# Altium project UHF Transceiver.PrjPCB (part 1 of 3)
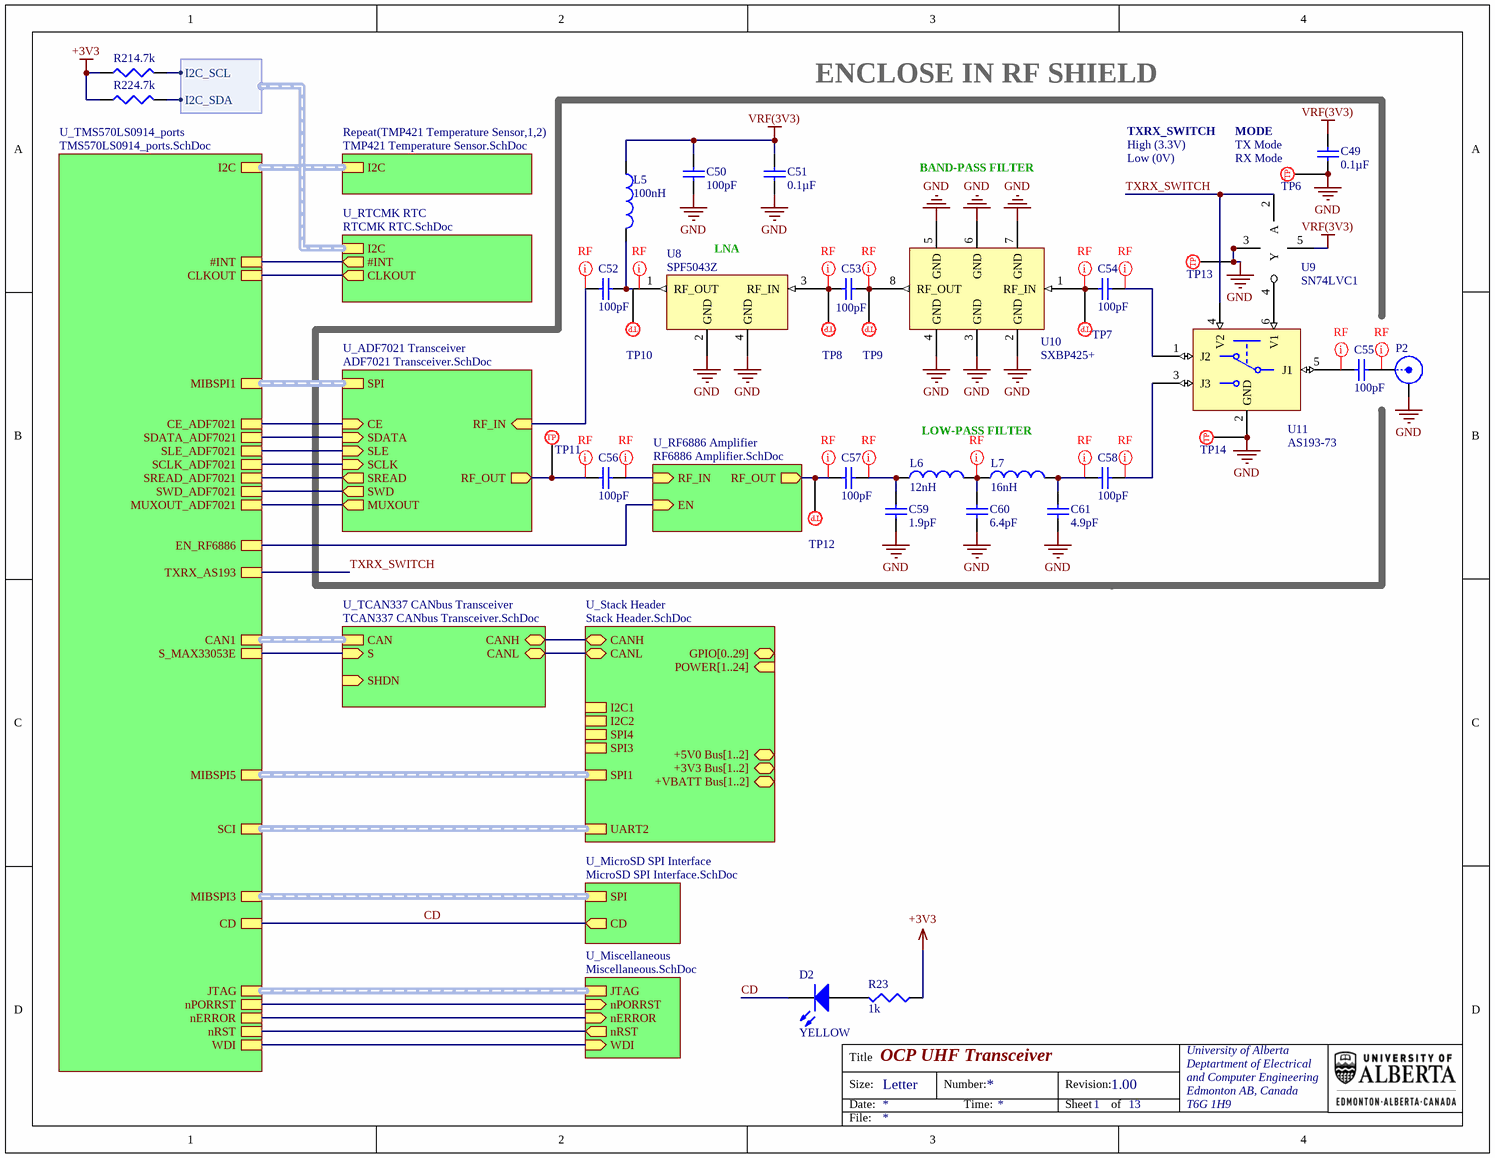
[diagram p0: UHF Transceiver Schematic.SchDoc]
11 sheets, 187 parts. Net scope: hierarchical (ports join the sheet entries above them; power ports are global).
Board file: UHF Transceiver PCB.PcbDoc
Sheets:
  UHF Transceiver Schematic.SchDoc
    TMP421 Temperature Sensor1 = TMP421 Temperature Sensor.SchDoc
    TMP421 Temperature Sensor2 = TMP421 Temperature Sensor.SchDoc
    U_RF6886 Amplifier = RF6886 Amplifier.SchDoc
    U_ADF7021 Transceiver = ADF7021 Transceiver.SchDoc
    U_RTCMK RTC = RTCMK RTC.SchDoc
    U_Stack Header = Stack Header.SchDoc
    U_MicroSD SPI Interface = MicroSD SPI Interface.SchDoc
    U_Miscellaneous = Miscellaneous.SchDoc
    U_TMS570LS0914_ports = TMS570LS0914_ports.SchDoc
      U_TMS570LS0914_all = TMS570LS0914_all.SchDoc
    U_TCAN337 CANbus Transceiver = TCAN337 CANbus Transceiver.SchDoc

## Sheet UHF Transceiver Schematic.SchDoc: OCP UHF Transceiver
size Letter; Revision: 1.00; SheetNumber: 1; SheetTotal: 13

### Parts
C49  value 0.1µF  [TDK-CGA2B]  (hidden comment: Cap)
C50  value 100pF  [KEM-CBR04]  (hidden comment: Cap)
C51  value 0.1µF  [TDK-CGA2B]  (hidden comment: Cap)
C52  value 100pF  [KEM-CBR04]  (hidden comment: Cap)
C53  value 100pF  [KEM-CBR04]  (hidden comment: Cap)
C54  value 100pF  [KEM-CBR04]  (hidden comment: Cap)
C55  value 100pF  [KEM-CBR04]  (hidden comment: Cap)
C56  value 100pF  [KEM-CBR04]  (hidden comment: Cap)
C57  value 100pF  [KEM-CBR04]  (hidden comment: Cap)
C58  value 100pF  [KEM-CBR04]  (hidden comment: Cap)
C59  value 1.9pF  [KEM-CBR04]  (hidden comment: Cap)
C60  value 6.4pF  [KEM-CBR04]  (hidden comment: Cap)
C61  value 4.9pF  [KEM-CBR04]  (hidden comment: Cap)
D2  value YELLOW  [WL-150060XS75000]  (hidden comment: LED)
L5  value 100nH  [TDK-MLF1005]  (hidden comment: MLF1005VR10JTD25)
L6  value 12nH  [MUR-LQW15A]  (hidden comment: LQW15AN12NG8ZD)
L7  value 16nH  [MUR-LQW15A]  (hidden comment: LQW15AN16NG8ZD)
P2  903-518J-51P  [AMP-903-518J-51P]  (value not drawn)
R21  value 4.7k  [PANA-ERJ2R]  (hidden comment: Res3)
R22  value 4.7k  [PANA-ERJ2R]  (hidden comment: Res3)
R23  value 1k  [PANA-ERJ3EK]  (hidden comment: Res3)
TP6  5017  [KS-5017]  (value not drawn)
TP7  5017  [KS-5017]  (value not drawn)
TP8  5017  [KS-5017]  (value not drawn)
TP9  5017  [KS-5017]  (value not drawn)
TP10  5017  [KS-5017]  (value not drawn)
TP11  5017  [KS-5017]  (value not drawn)
TP12  5017  [KS-5017]  (value not drawn)
TP13  5017  [KS-5017]  (value not drawn)
TP14  5017  [KS-5017]  (value not drawn)
U8  SPF5043Z  [QRV-SOT-343-4]
U9  SN74LVC1  [TI-DBV0005A]
U10  SXBP425+  [MICI-SXBP]
U11  AS193-73  [SKYW-SOT-6]

### Sub-sheets
Repeat(TMP421 Temperature Sensor,1,2) = TMP421 Temperature Sensor.SchDoc: I2C (harness MCU_I2C0)
U_ADF7021 Transceiver = ADF7021 Transceiver.SchDoc: RF_OUT (out), RF_IN (in), CE (in), SDATA (in), SREAD (out), SLE (in), SWD (out), SCLK (in), MUXOUT (out), SPI (harness ADF7021_SPI)
U_MicroSD SPI Interface = MicroSD SPI Interface.SchDoc: CD (out), SPI (harness MicroSD_SPI)
U_Miscellaneous = Miscellaneous.SchDoc: JTAG (harness TMS570_JTAG), nRST (out), nERROR (in), nPORRST (in), WDI (in)
U_RF6886 Amplifier = RF6886 Amplifier.SchDoc: RF_IN (in), RF_OUT (out), EN (in)
U_RTCMK RTC = RTCMK RTC.SchDoc: CLKOUT (out), #INT (out), I2C (harness MCU_I2C0)
U_Stack Header = Stack Header.SchDoc: CANH (bidir), CANL (bidir), SPI1 (harness STACK_SPI1), I2C1 (harness STACK_I2C1), SPI3 (harness STACK_SPI3), GPIO[0..29] (bidir), +VBATT Bus[1..2] (bidir), POWER[1..24] (in), SPI4 (harness STACK_SPI0), I2C2 (harness STACK_I2C0), +5V0 Bus[1..2] (bidir), +3V3 Bus[1..2] (bidir), UART2 (harness STACK_UART2)
U_TCAN337 CANbus Transceiver = TCAN337 CANbus Transceiver.SchDoc: CANH (bidir), CANL (bidir), CAN (harness MAX33053E_CAN), S (in), SHDN (in)
U_TMS570LS0914_ports = TMS570LS0914_ports.SchDoc: nRST, nPORRST, SREAD_ADF7021, CE_ADF7021, SWD_ADF7021, MUXOUT_ADF7021, SDATA_ADF7021, SLE_ADF7021, SCLK_ADF7021, TXRX_AS193, CD, #INT, S_MAX33053E, EN_RF6886, CLKOUT, WDI, nERROR, I2C (harness MCU_I2C0), CAN1, MIBSPI5, SCI, MIBSPI1, JTAG, MIBSPI3

### Harnesses
MCU_I2C0: I2C_SCL, I2C_SDA

### Nets
+3V3: R21.1 R22.1 R23.1  [project net POWER19]
GND: C49.2 C50.1 C51.2 C59.1 C60.1 C61.1 P2.2(Y) TP6.1 TP13.1 TP14.1 U8.2(GND) U8.4(GND) U9.1(NC) U9.3(GND) U10.2(GND) U10.3(GND) U10.4(GND) U10.5(GND) U10.6(GND) U10.7(GND) U11.2(GND)
VRF(3V3): C49.1 C50.2 C51.1 L5.1 U9.5(VCC)
CAN_N: sheet U_Stack Header/CANL, sheet U_TCAN337 CANbus Transceiver/CANL
CAN_P: sheet U_Stack Header/CANH, sheet U_TCAN337 CANbus Transceiver/CANH
CD: D2.2(K) ; sheet U_MicroSD SPI Interface/CD, sheet U_TMS570LS0914_ports/CD
EPWM1A: sheet U_ADF7021 Transceiver/CE, sheet U_TMS570LS0914_ports/CE_ADF7021
EPWM1B: sheet U_ADF7021 Transceiver/SDATA, sheet U_TMS570LS0914_ports/SDATA_ADF7021
EPWM2A: sheet U_ADF7021 Transceiver/SLE, sheet U_TMS570LS0914_ports/SLE_ADF7021
EPWM3A: sheet U_RTCMK RTC/CLKOUT, sheet U_TMS570LS0914_ports/CLKOUT
EQEP2A: sheet U_RF6886 Amplifier/EN, sheet U_TMS570LS0914_ports/EN_RF6886
EQEP2I: sheet U_ADF7021 Transceiver/MUXOUT, sheet U_TMS570LS0914_ports/MUXOUT_ADF7021
GIOA0: sheet U_ADF7021 Transceiver/SREAD, sheet U_TMS570LS0914_ports/SREAD_ADF7021
GIOA1: sheet U_ADF7021 Transceiver/SWD, sheet U_TMS570LS0914_ports/SWD_ADF7021
GIOB0: sheet U_ADF7021 Transceiver/SCLK, sheet U_TMS570LS0914_ports/SCLK_ADF7021
GIOB1: sheet U_RTCMK RTC/#INT, sheet U_TMS570LS0914_ports/#INT
GIOB2: sheet U_TMS570LS0914_ports/S_MAX33053E, sheet U_TCAN337 CANbus Transceiver/S
I2C_SCL: R21.2 ; sheet Repeat(TMP421 Temperature Sensor,1,2)/I2C.I2C_SCL
I2C_SDA: R22.2 ; sheet Repeat(TMP421 Temperature Sensor,1,2)/I2C.I2C_SDA
N2HET1_24: sheet U_Miscellaneous/WDI, sheet U_TMS570LS0914_ports/WDI
nERROR: sheet U_Miscellaneous/nERROR, sheet U_TMS570LS0914_ports/nERROR
nPORRST: sheet U_Miscellaneous/nPORRST, sheet U_TMS570LS0914_ports/nPORRST
nRST: sheet U_Miscellaneous/nRST, sheet U_TMS570LS0914_ports/nRST
TXRX_SWITCH: U9.2(A) U11.4(V2) ; sheet U_TMS570LS0914_ports/TXRX_AS193  [project net GIOB3]
NetC41_2: C57.2 TP12.1 ; sheet U_RF6886 Amplifier/RF_OUT
NetC44_1: C56.1 ; sheet U_RF6886 Amplifier/RF_IN
NetC52_1: C52.1 L5.2 TP10.1 U8.1(RF_OUT)
NetC52_2: C52.2 ; sheet U_ADF7021 Transceiver/RF_IN
NetC53_1: C53.1 TP9.1 U10.8(RF_OUT)
NetC53_2: C53.2 TP8.1 U8.3(RF_IN)
NetC54_1: C54.1 U11.1(J2)
NetC54_2: C54.2 TP7.1 U10.1(RF_IN)
NetC55_1: C55.1 P2.1(X)
NetC55_2: C55.2 U11.5(J1)
NetC56_2: C56.2 TP11.1 ; sheet U_ADF7021 Transceiver/RF_OUT
NetC57_1: C57.1 C59.2 L6.1
NetC58_1: C58.1 U11.3(J3)
NetC58_2: C58.2 C61.2 L7.2
NetC60_2: C60.2 L6.2 L7.1
NetD2_1: D2.1(A) R23.2
NetU9_4: U9.4(Y) U11.6(V1)

### Buses and harness runs
harness sheet Repeat(TMP421 Temperature Sensor,1,2)/I2C = sheet U_RTCMK RTC/I2C = sheet U_TMS570LS0914_ports/I2C
harness sheet U_ADF7021 Transceiver/SPI = sheet U_TMS570LS0914_ports/MIBSPI1
harness sheet U_MicroSD SPI Interface/SPI = sheet U_TMS570LS0914_ports/MIBSPI3
harness sheet U_Miscellaneous/JTAG = sheet U_TMS570LS0914_ports/JTAG
harness sheet U_Stack Header/SPI1 = sheet U_TMS570LS0914_ports/MIBSPI5
harness sheet U_Stack Header/UART2 = sheet U_TMS570LS0914_ports/SCI
harness sheet U_TCAN337 CANbus Transceiver/CAN = sheet U_TMS570LS0914_ports/CAN1

### Layout directives
net class RF; rule Impedance Constraint [Min = 50.00    Max = 50.00    ]: (no net found under the mark), NetC41_2, NetC44_1, NetC52_2, NetC53_1, NetC53_2, NetC54_1, NetC54_2, NetC55_1, NetC55_2, NetC56_2, NetC57_1, NetC58_1, NetC58_2, NetC60_2

### Notes on the sheet
- ENCLOSE IN RF SHIELD
- BAND-PASS FILTER
- TXRX_SWITCH
- High (3.3V)
- Low (0V)
- MODE
- (near TP6) TX Mode
- (near TP6) RX Mode
- (near U8) LNA
- LOW-PASS FILTER
- Title
- Size:
- Date:
- Letter
- Number:
- Time:
- Revision:
- Sheet
- of
- University of Alberta
- Deptartment of Electrical
- and Computer Engineering
- Edmonton AB, Canada
- T6G 1H9
- File:
- (in symbol PTP-KS-00001) TP

### Library data of the parts
C49 C51 = PC-TDK-02259: CAP CER 0.1UF 50V X7R 0402; Manufacturer Part Number: CGA2B3X7R1H104K050BB; Index: 2259; Designator: C?; Tolerance: ±10%; Published: 2016-03-16; LatestRevisionDate: 2016-03-16; LatestRevisionNote: ...; PackageReference: 0402 (1005 Metric); Publisher: AlbertaSat; PackageDescription: Radial Cap, Thru-Hole; 2 Leads; 0.3 in Pin Spacing; Part Number: PC-TDK-02259; Supplier Part Number 1: 445-6899-1-ND; Supplier 1: Digi-key; Supplier Link: http://www.digikey.ca/product-search/en?keywords=445-6899-1-ND; Voltage - Rated: 50V; Temperature Coefficient: X7R; Applications: Automotive
C50 C52-C58 = PC-KEM-03159: CAP CER SMD CBR 0402 100PF 5% 25; Manufacturer Part Number: CBR04C101J3GAC; Index: 3159; Designator: C?; Voltage - Rated: 25V; Temperature Coefficient: C0G, NP0; Published: 2018-08-29; LatestRevisionDate: 2018-08-29; LatestRevisionNote: ...; PackageReference: 0402 (1005 Metric); Publisher: AlbertaSat; PackageDescription: Chip Capacitor, 2-Leads, Body 1.00x0.50mm, IPC Low Density; Part Number: PC-KEM-03159; Supplier Part Number 1: 399-17684-1-ND; Supplier 1: Digi-key; Supplier Link: https://www.digikey.ca/products/en?keywords=399-17684-1-ND; Tolerance: ±5%; Applications: High Q, Low Loss, Ultra Low ESR
C59 = PC-KEM-02905: CAP CER RF 1.9PF 50V +/-0.1 PF C; Manufacturer Part Number: CBR04C199B5GAC; Index: 2905; Designator: C?; Tolerance: ±0.1pF; Temperature Coefficient: C0G, NP0; Published: 2018-08-29; LatestRevisionDate: 2018-08-29; LatestRevisionNote: ...; PackageReference: 0402 (1005 Metric); Publisher: AlbertaSat; PackageDescription: Chip Capacitor, 2-Leads, Body 1.00x0.50mm, IPC Low Density; Part Number: PC-KEM-02905; Supplier Part Number 1: 399-16064-1-ND; Supplier 1: Digi-key; Supplier Link: https://www.digikey.ca/products/en?keywords=399-16064-1-ND; Voltage - Rated: 50V; Applications: High Q, Low Loss, Ultra Low ESR
C60 = PC-KEM-03022: CAP CER RF 6.4PF 50V +/-0.1 PF C; Manufacturer Part Number: CBR04C649B5GAC; Index: 3022; Designator: C?; Tolerance: ±0.1pF; Temperature Coefficient: C0G, NP0; Published: 2018-08-29; LatestRevisionDate: 2018-08-29; LatestRevisionNote: ...; PackageReference: 0402 (1005 Metric); Publisher: AlbertaSat; PackageDescription: Chip Capacitor, 2-Leads, Body 1.00x0.50mm, IPC Low Density; Part Number: PC-KEM-03022; Supplier Part Number 1: 399-16107-1-ND; Supplier 1: Digi-key; Supplier Link: https://www.digikey.ca/products/en?keywords=399-16107-1-ND; Voltage - Rated: 50V; Applications: High Q, Low Loss, Ultra Low ESR
C61 = PC-KEM-02983: CAP CER RF 4.9PF 50V +/-0.1 PF C; Manufacturer Part Number: CBR04C499B5GAC; Index: 2983; Designator: C?; Tolerance: ±0.1pF; Temperature Coefficient: C0G, NP0; Published: 2018-08-29; LatestRevisionDate: 2018-08-29; LatestRevisionNote: ...; PackageReference: 0402 (1005 Metric); Publisher: AlbertaSat; PackageDescription: Chip Capacitor, 2-Leads, Body 1.00x0.50mm, IPC Low Density; Part Number: PC-KEM-02983; Supplier Part Number 1: 399-16093-1-ND; Supplier 1: Digi-key; Supplier Link: https://www.digikey.ca/products/en?keywords=399-16093-1-ND; Voltage - Rated: 50V; Applications: High Q, Low Loss, Ultra Low ESR
D2 = 5: LED YELLOW CLEAR 0603 SMD; Part Number: 5; Manufacturer Part Number: 150060YS75000; Designator: D?; Brightness: 120mcd; Published: 8-Jun-2000; LatestRevisionDate: 08-Jul-2005; LatestRevisionNote: Mech Layer 1 removed.; PackageReference: WL-150060XS75000; Publisher: Altium Limited; PackageDescription: LED; 2 Leads; Supplier Part Number 1: 732-4981-1-ND; Supplier 1: Digi-Key; Supplier Link: http://www.digikey.ca/product-search/en?keywords=732-4981-1-ND
L5 = PL-TDK-02957: FIXD IND 100NH 180MA 510MOHM SMD; Code_IEC: 1005; Index: 2957; Designator: L?; Tolerance: ±5%; Published: 2018-12-12; LatestRevisionDate: 2018-12-12; LatestRevisionNote: ...; PackageReference: 0402 (1005 Metric); Publisher: AlbertaSat; PackageDescription: Chip Inductor, 2-Leads, Body 1.00x0.50mm, IPC Low Density; Code_JEITA: 0402; Part Number: PL-TDK-02957; Manufacturer Part Number: MLF1005VR10JTD25; Supplier Part Number 1: 445-180212-1-ND; Supplier 1: Digi-key; Supplier Part Number 2: 810-MLF1005VR10JTD25; Supplier 2: Mouser; Supplier Link: #https://www.digikey.ca/product-detail/en/tdk-corporation/MLF1005VR10JTD25/445-180212-1-ND/8638399#; Current - Rated: 180mA
L6 = 10160: FIXED IND 12NH 1.24A 93 MOHM; Part Number: 10160; Code_IEC: 1005; Designator: L?; DC Resistance: 93 mOhm Max; Tolerance: ±2%; Published: 8-Jun-2000; LatestRevisionDate: 29-May-2009; LatestRevisionNote: IPC-7351 Footprint Added.; PackageReference: 0402 (1005 Metric); Publisher: Altium Limited; PackageDescription: Chip Inductor, 2-Leads, Body 1.00x0.60mm, IPC Low Density; Code_JEITA: 0402; Manufacturer Part Number: LQW15AN12NG8ZD; Supplier Part Number 1: 490-15335-1-ND; Supplier 1: Digi-Key; Supplier Link: #https://www.digikey.ca/product-detail/en/murata-electronics-north-america/LQW15AN12NG8ZD/490-15335-1-ND/6800000#
L7 = 10161: FIXED IND 16NH 1A 126 MOHM; Part Number: 10161; Code_IEC: 1005; Designator: L?; DC Resistance: 126 mOhm Max; Tolerance: ±2%; Published: 8-Jun-2000; LatestRevisionDate: 29-May-2009; LatestRevisionNote: IPC-7351 Footprint Added.; PackageReference: 0402 (1005 Metric); Publisher: Altium Limited; PackageDescription: Chip Inductor, 2-Leads, Body 1.00x0.60mm, IPC Low Density; Code_JEITA: 0402; Manufacturer Part Number: LQW15AN16NG8ZD; Supplier Part Number 1: 490-15343-1-ND; Supplier 1: Digi-Key; Supplier Link: #https://www.digikey.ca/product-detail/en/murata-electronics-north-america/LQW15AN16NG8ZD/490-15343-1-ND/6800008#
P2 = PP-AMP-00002: CONN SMB JACK STR 50OHM EDGE MNT; Index: 2; Designator: P?; LatestRevisionDate: 2018-12-20; LatestRevisionNote: ...; Publisher: AlbertaSat; Part Number: PP-AMP-00002; Manufacturer Part Number: 903-518J-51P; Supplier Part Number 1: ARF1721-ND; Supplier 1: Digi-key; Supplier Part Number 2: 523-903-518J-51P; Supplier 2: Mouser; Published: 2018-12-20; PackageReference: CONN SMB JACK STR 50OHM EDGE MNT; PackageDescription: CONN SMB JACK STR 50OHM EDGE MNT; Supplier Link: #https://www.digikey.ca/product-detail/en/amphenol-rf-division/903-518J-51P/ARF1721-ND/2041847#
R21 R22 = 16657: RES SMD 4.7K OHM 1% 1/10W 0402; Part Number: 16657; Manufacturer Part Number: ERJ-2RKF4701X; Designator: R?; Power: 0.1W, 1/10W; Temperature Coefficient: ±100ppm/°C; Published: 8-Jun-2000; LatestRevisionDate: 29-May-2009; LatestRevisionNote: IPC-7351 Footprint Added.; PackageReference: 0402 (1005 Metric); Publisher: Altium Limited; PackageDescription: Chip Resistor, 2-Leads, Body 1.00x0.50mm, IPC Low Density; Supplier Part Number 1: P4.70KLCT-ND; Supplier 1: Digi-Key; Supplier Link: http://www.digikey.ca/product-search/en?keywords=P4.70KLCT-ND; Tolerance: ±1%
R23 = 15398: RES SMD 1K OHM 1% 1/10W 0603; Part Number: 15398; Manufacturer Part Number: ERJ-3EKF1001V; Designator: R?; Power: 0.1W, 1/10W; Temperature Coefficient: ±100ppm/°C; Published: 8-Jun-2000; LatestRevisionDate: 29-May-2009; LatestRevisionNote: IPC-7351 Footprint Added.; PackageReference: 0603 (1608 Metric); Publisher: Altium Limited; PackageDescription: Chip Resistor, 2-Leads, Body 1.60x0.80mm, IPC Low Density; Supplier Part Number 1: P1.00KHCT-ND; Supplier 1: Digi-Key; Supplier Link: http://www.digikey.ca/product-search/en?keywords=P1.00KHCT-ND; Tolerance: ±1%
TP6-TP14 = PTP-KS-00001: PC TEST POINT MINI SMD; Index: 1; Designator: TP?; Supplier 1: Digi-key; Supplier 2: Newark; Supplier 3: Mouser; Part Number: PTP-KS-00001; Manufacturer Part Number: 5017; Supplier Part Number 1: 36-5017CT-ND; Publisher: AlbertaSat; Published: 2016-03-15; LatestRevisionDate: 2016-03-15; LatestRevisionNote: ...; PackageReference: KS-5017; PackageDescription: Testpoint Lug Mini SMD 27X10X152; Supplier Link: #http://www.digikey.ca/product-detail/en/keystone-electronics/5017/36-5017TR-ND/2217304#
U8 = PU-QRV-00002: RF Amplifier .05-4GHz SSG 12.9dB NF .8dB GaAs; Index: 2; Designator: U?; Opperating Supply Current: 46 mA; Operating Frequency: 50 MHz to 4 GHz; Operating Supply Voltage: 5V; Part Number: PU-QRV-00002; Manufacturer Part Number: SPF5043Z; Supplier Part Number 1: 772-SPF5043Z; Supplier 1: Mouser; Supplier Part Number 2: SPF5043Z; Supplier 2: Avnet Asia; Publisher: AlbertaSat; Published: 2018-05-28; LatestRevisionDate: 2018-05-28; LatestRevisionNote: ...; PackageReference: SOT-343-4; PackageDescription: SOT143, 4-Leads, Body 2.00x2.10mm, Pitch 1.30mm, IPC Medium Density; Supplier Link: #https://www.mouser.ca/ProductDetail/Qorvo/SPF5043Z?qs=p6lVfQR1GSoUob90DTnCEA%3D%3D#; Gain: 12.9 dB; Operating Temperature: -40°C ~ 85°C (TA; Applications: Wireless & RF Integrated Circuits
U9 = 52: IC INVERTER SCHMITT 1CH SOT23-5; Part Number: 52; Manufacturer Part Number: SN74LVC1G14MDBVREP; Designator: U?; Voltage - Supply: 1.65 V ~ 5.5 V; Current - Output (Max): ±50 mA; Supplier Part Number 2: 595-SN74LVC14MDBVREP; Supplier 2: Mouser; Supplier Part Number 1: 296-22346-1-ND; Supplier 1: Digi-Key; Supplier Link: #https://www.digikey.ca/products/en?keywords=296-22346-1-ND#; PackageReference: SOT-23-5, SC-74A, SOT-753; Operating Temperature: -55°C ~ 125°C
U10 = PU-MICI-00002: Band Pass Filter; Index: 2; Designator: U?; PassBand: 410 to 440 MHz; Part Number: PU-MICI-00002; Manufacturer Part Number: SXBP-425+; Supplier Part Number 1: SXBP-425+; Supplier 1: Mini Circuits; Publisher: AlbertaSat; Published: 2018-12-19; LatestRevisionDate: 2018-12-19; LatestRevisionNote: ...; Supplier Link: #https://www.minicircuits.com/WebStore/dashboard.html?model=SXBP-425%2B#
U11 = PU-SKYW-00003: IC SW SPDT 0.1-2.5GHZ SOT6; Manufacturer Part Number: AS193-73LF; Index: 3; Designator: U?; Part Number: PU-SKYW-00003; Supplier Part Number 1: 863-1006-1-ND; Supplier 1: Digi-key; Supplier Part Number 2: 873-AS193-73LF; Supplier 2: Mouser; Publisher: AlbertaSat; Published: 2018-05-18; LatestRevisionDate: 2018-05-18; LatestRevisionNote: ...; PackageReference: SOT-23 6L; PackageDescription: SOT23, 6-Leads, Body 2.90x2.70mm, Pitch 0.95mm, IPC Medium Density; Supplier Link: #https://www.digikey.ca/products/en?keywords=863-1006-1-ND#

## Sheet TMP421 Temperature Sensor.SchDoc: TMP421 Temperature Sensor
size Letter; SheetNumber: 10; SheetTotal: 11
Used 2 times, as channels TMP421 Temperature Sensor1, TMP421 Temperature Sensor2. Parts and nets are listed once, with the designators drawn on the sheet.
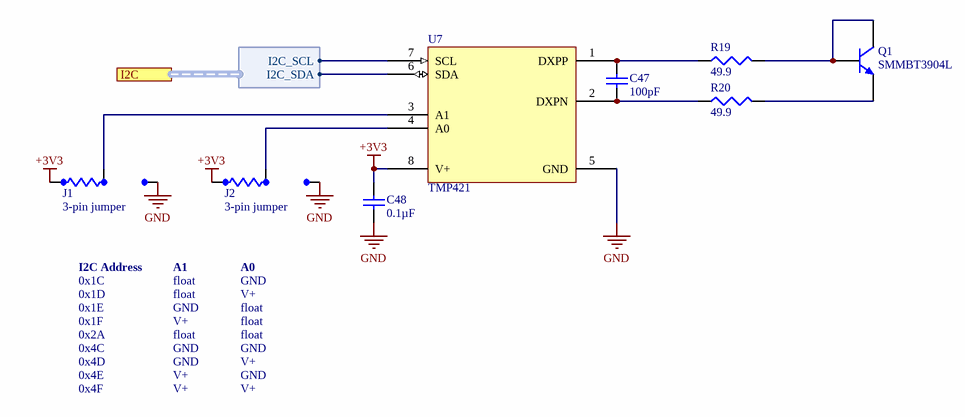
[diagram p1: TMP421 Temperature Sensor.SchDoc]

### Parts
C47  value 100pF  [TDK-CGA2B]  (hidden comment: Cap)
C48  value 0.1µF  [TDK-CGA2B]  (hidden comment: Cap)
J1  3-pin jumper  [PANA-ERJ3EK(3-pin jumper)]
J2  3-pin jumper  [PANA-ERJ3EK(3-pin jumper)]
Q1  SMMBT3904L  [ONS-318-08]
R19  value 49.9  [PANA-ERA2A]  (hidden comment: Res3)
R20  value 49.9  [PANA-ERA2A]  (hidden comment: Res3)
U7  TMP421  [TI-DCN]

### Ports
I2C (harness TMP421_I2C)

### Harnesses
TMP421_I2C: I2C_SCL, I2C_SDA

### Nets
+3V3: C48.1 J1.3 J2.3 U7.8(V+)
GND: C48.2 J1.1 J2.1 U7.5(GND)
NetC47_1: C47.1 R20.1 U7.2(DXPN)
NetC47_2: C47.2 R19.1 U7.1(DXPP)
NetJ1_2: J1.2 U7.3(A1)
NetJ2_2: J2.2 U7.4(A0)
NetQ1_1: Q1.1(B) Q1.3(C) R19.2
NetQ1_2: Q1.2(E) R20.2
NetU7_6: U7.6(SDA) ; port I2C.I2C_SDA
NetU7_7: U7.7(SCL) ; port I2C.I2C_SCL

### Channels
TMP421 Temperature Sensor1: designators end in _TMP421_Temperature_Sensor1
TMP421 Temperature Sensor2: designators end in _TMP421_Temperature_Sensor2

### Notes on the sheet
- I2C Address
- 0x1C
- A1
- float
- A0
- GND
- 0x1D
- 0x1E
- 0x1F
- 0x2A
- 0x4C
- V+
- 0x4D
- 0x4E
- 0x4F
- (the "License"); you may not use or redistribute this file except in compliance with the License. You
- This file and the information within it are licensed under the terms of the Apache License, Version 2.0
- Copyright
- Unless required by applicable law or agreed to in writing, content distributed under the License is
- distributed on an "AS IS" BASIS, WITHOUT WARRANTIES OR CONDITIONS OF ANY KIND,
- either express or implied. See the License for the specific language governing permissions and
- limitations under the License.
- may obtain a copy of the License at:
- http://www.apache.org/licenses/LICENSE-2.0
- Title
- Size:
- Date:
- Letter
- Number:
- Time:
- Revision:
- Sheet
- of
- University of Alberta
- Deptartment of Electrical
- and Computer Engineering
- Edmonton AB, Canada
- T6G 1H9
- File:

### Library data of the parts
C47 = PC-TDK-01226: CAP CER 100PF 100V C0G 0402; Manufacturer Part Number: CGA2B2C0G2A101J050BA; Index: 1226; Designator: C?; Tolerance: ±5%; Temperature Coefficient: NP0; Published: 2016-03-16; LatestRevisionDate: 2016-03-16; LatestRevisionNote: ...; PackageReference: 0402 (1005 Metric); Publisher: AlbertaSat; PackageDescription: Radial Cap, Thru-Hole; 2 Leads; 0.3 in Pin Spacing; Part Number: PC-TDK-01226; Supplier Part Number 1: 445-15510-1-ND; Supplier 1: Digi-key; Supplier Link: http://www.digikey.ca/product-search/en?keywords=445-15510-1-ND; Voltage - Rated: 100V; Applications: Automotive
C48 = PC-TDK-02259: as C49 on sheet UHF Transceiver Schematic; Published: 2016-03-16; LatestRevisionDate: 2016-03-16; LatestRevisionNote: ...; PackageReference: 0402 (1005 Metric); Publisher: AlbertaSat; PackageDescription: Radial Cap, Thru-Hole; 2 Leads; 0.3 in Pin Spacing; Part Number: PC-TDK-02259; Supplier Part Number 1: 445-6899-1-ND; Supplier 1: Digi-key; Supplier Link: http://www.digikey.ca/product-search/en?keywords=445-6899-1-ND; Voltage - Rated: 50V; Temperature Coefficient: X7R; Applications: Automotive
J1 J2 = 19867: Part Number: 19867; Supplier 1: Digi-Key
Q1 = PU-ONS-00001: TRANS NPN 40V 0.2A SOT23; Manufacturer Part Number: SMMBT3904LT1G; Index: 1; Designator: Q?; Part Number: PU-ONS-00001; Supplier Part Number 1: SMMBT3904LT1GOSCT-ND; Supplier 1: Digi-key; Supplier Part Number 2: 863-SMMBT3904LT1G; Supplier 2: Mouser; Publisher: AlbertaSat; Published: 2018-08-18; LatestRevisionDate: 2018-08-18; LatestRevisionNote: ...; PackageReference: SOT-23-3 (TO-236); PackageDescription: SOT23, 3-Leads, Body 2.92x2.37mm, Pitch 0.95mm, IPC Low Density; Supplier Link: #https://www.digikey.ca/product-detail/en/on-semiconductor/SMMBT3904LT1G/SMMBT3904LT1GOSCT-ND/4331837#
R19 R20 = 13731: RES SMD 49.9 OHM 0.1% 1/16W 0402; Part Number: 13731; Manufacturer Part Number: ERA-2AEB49R9X; Designator: R?; Power: 0.063W, 1/16W; Temperature Coefficient: ±25ppm/°C; Published: 8-Jun-2000; LatestRevisionDate: 29-May-2009; LatestRevisionNote: IPC-7351 Footprint Added.; PackageReference: 0402 (1005 Metric); Publisher: Altium Limited; PackageDescription: Chip Resistor, 2-Leads, Body 1.00x0.50mm, IPC Low Density; Supplier Part Number 1: P49.9DCCT-ND; Supplier 1: Digi-Key; Supplier Link: http://www.digikey.ca/product-search/en?keywords=P49.9DCCT-ND; Tolerance: ±0.1%
U7 = 40: SENSOR TEMPERATURE SMBUS SOT23-8; Part Number: 40; Manufacturer Part Number: TMP421AIDCNR; Designator: U?; Supplier Part Number 2: 595-TMP421AIDCNR; Supplier 2: Mouser; Supplier Part Number 1: 296-35959-1-ND; Supplier 1: Digi-Key; Supplier Link: #https://www.digikey.ca/product-detail/en/texas-instruments/TMP421AIDCNR/296-35959-1-ND/4135040#; PackageReference: SOT-23-8; Operating Temperature: -40°C ~ 125°C

## Sheet RF6886 Amplifier.SchDoc: RF6886 Amplifier
size Letter; SheetNumber: 3; SheetTotal: 11
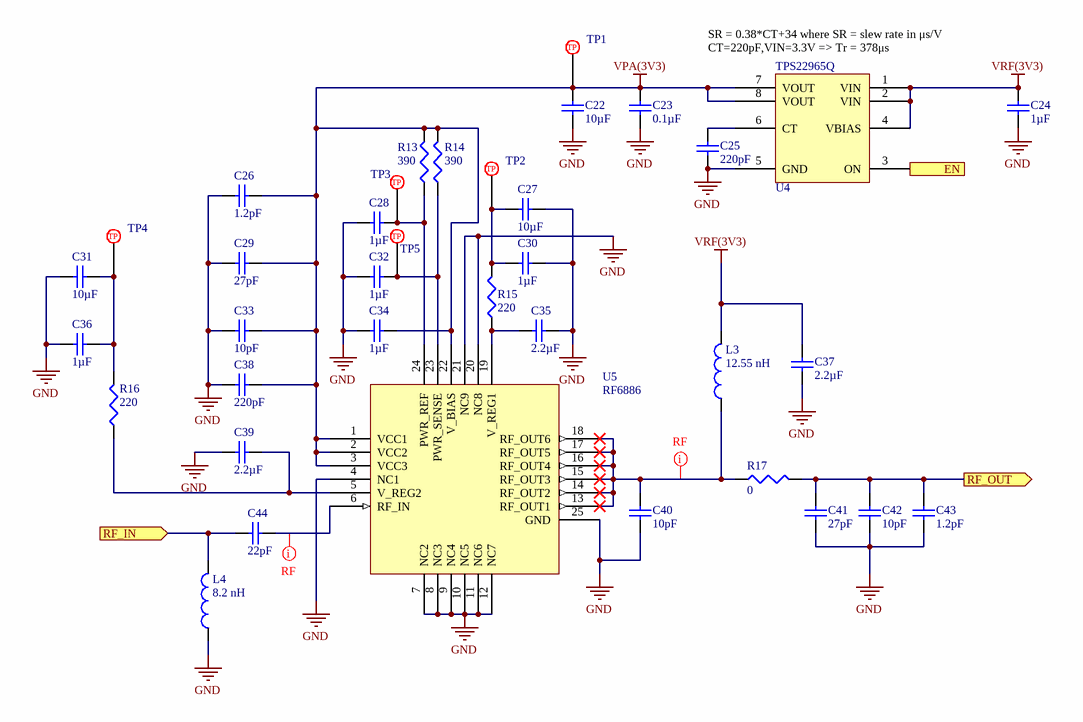
[diagram p2: RF6886 Amplifier.SchDoc]

### Parts
C22  value 10µF  [TDK-CGA5L]  (hidden comment: Cap)
C23  value 0.1µF  [TDK-CGA2B]  (hidden comment: Cap)
C24  value 1µF  [TDK-CGA3E]  (hidden comment: Cap)
C25  value 220pF  [TDK-CGA2B]  (hidden comment: Cap)
C26  value 1.2pF  [ATC-600S]  (hidden comment: Cap)
C27  value 10µF  [TDK-CGA5L]  (hidden comment: Cap)
C28  value 1µF  [TDK-CGA3E]  (hidden comment: Cap)
C29  value 27pF  [ATC-600S]  (hidden comment: Cap)
C30  value 1µF  [TDK-CGA3E]  (hidden comment: Cap)
C31  value 10µF  [TDK-CGA5L]  (hidden comment: Cap)
C32  value 1µF  [TDK-CGA3E]  (hidden comment: Cap)
C33  value 10pF  [ATC-600S]  (hidden comment: Cap)
C34  value 1µF  [TDK-CGA3E]  (hidden comment: Cap)
C35  value 2.2µF  [TDK-CGA4J]  (hidden comment: Cap)
C36  value 1µF  [TDK-CGA3E]  (hidden comment: Cap)
C37  value 2.2µF  [TDK-CGA4J]  (hidden comment: Cap)
C38  value 220pF  [ATC-600F]  (hidden comment: Cap)
C39  value 2.2µF  [TDK-CGA4J]  (hidden comment: Cap)
C40  value 10pF  [ATC-600L]  (hidden comment: Cap)
C41  value 27pF  [ATC-600L]  (hidden comment: Cap)
C42  value 10pF  [ATC-600L]  (hidden comment: Cap)
C43  value 1.2pF  [ATC-600L]  (hidden comment: Cap)
C44  value 22pF  [ATC-600L]  (hidden comment: Cap)
L3  value 12.55 nH  [1606-10GLC]  (hidden comment: 2 % tolerence)
L4  value 8.2 nH  [CCI-0402CS]  (hidden comment: 0402CS-8N2XGLW)
R13  value 390  [PANA-ERA2A]  (hidden comment: Res3)
R14  value 390  [PANA-ERA2A]  (hidden comment: Res3)
R15  value 220  [PANA-ERA3A]  (hidden comment: Res3)
R16  value 220  [PANA-ERA3A]  (hidden comment: Res3)
R17  value 0  [PANA-ERJ2G]  (hidden comment: Jumper)
TP1  5017  [KS-5017]  (value not drawn)
TP2  5017  [KS-5017]  (value not drawn)
TP3  5017  [KS-5017]  (value not drawn)
TP4  5017  [KS-5017]  (value not drawn)
TP5  5017  [KS-5017]  (value not drawn)
U4  TPS22965Q  [TI-DSG0008]
U5  RF6886  [24-VFQFN]

### Ports
EN (in), RF_IN (in), RF_OUT (out)

### Nets
GND: C22.2 C23.1 C24.1 C25.1 C26.1 C27.2 C28.2 C29.1 C30.1 C31.1 C32.2 C33.1 C34.2 C35.1 C36.2 C37.1 C38.1 C39.2 C40.1 C41.1 C42.1 C43.1 L4.1 U4.5(GND) U5.4(NC1) U5.7(NC2) U5.8(NC3) U5.9(NC4) U5.10(NC5) U5.11(NC6) U5.12(NC7) U5.20(NC8) U5.21(NC9) U5.25(GND)
VPA(3V3): C22.1 C23.2 C26.2 C29.2 C33.2 C34.1 C38.2 R13.2 R14.2 TP1.1 U4.7(VOUT) U4.8(VOUT) U5.1(VCC1) U5.2(VCC2) U5.3(VCC3) U5.22(V_BIAS)
VRF(3V3): C24.2 C37.2 L3.2 U4.1(VIN) U4.2(VIN) U4.4(VBIAS)
EQEP2A: U4.3(ON) ; port EN
NetC25_2: C25.2 U4.6(CT)
NetC27_1: C27.1 C30.2 R15.2 TP2.1
NetC28_1: C28.1 R13.1 TP3.1 U5.24(PWR_REF)
NetC31_2: C31.2 C36.1 R16.2 TP4.1
NetC32_1: C32.1 R14.1 TP5.1 U5.23(PWR_SENSE)
NetC35_2: C35.2 R15.1 U5.19(V_REG1)
NetC39_1: C39.1 R16.1 U5.5(V_REG2)
NetC40_2: C40.2 L3.1 R17.1 U5.13(RF_OUT1) U5.14(RF_OUT2) U5.15(RF_OUT3) U5.16(RF_OUT4) U5.17(RF_OUT5) U5.18(RF_OUT6)
NetC41_2: C41.2 C42.2 C43.2 R17.2 ; port RF_OUT
NetC44_1: C44.1 L4.2 ; port RF_IN
NetC44_2: C44.2 U5.6(RF_IN)

### Layout directives
net class RF; rule Impedance Constraint [Min = 50.00    Max = 50.00    ]: NetC40_2, NetC44_2

### Notes on the sheet
- SR = 0.38*CT+34 where SR = slew rate in μs/V
- (near U4) CT=220pF,VIN=3.3V => Tr = 378μs
- (the "License"); you may not use or redistribute this file except in compliance with the License. You
- This file and the information within it are licensed under the terms of the Apache License, Version 2.0
- Copyright
- Unless required by applicable law or agreed to in writing, content distributed under the License is
- distributed on an "AS IS" BASIS, WITHOUT WARRANTIES OR CONDITIONS OF ANY KIND,
- either express or implied. See the License for the specific language governing permissions and
- limitations under the License.
- may obtain a copy of the License at:
- http://www.apache.org/licenses/LICENSE-2.0
- Title
- Size:
- Date:
- Letter
- Number:
- Time:
- Revision:
- Sheet
- of
- University of Alberta
- Deptartment of Electrical
- and Computer Engineering
- Edmonton AB, Canada
- T6G 1H9
- File:
- (in symbol PTP-KS-00001) TP

### Library data of the parts
C22 C27 C31 = PC-TDK-02917: CAP CER 10UF 25V X7R 1206; Manufacturer Part Number: CGA5L1X7R1E106K160AC; Index: 2917; Tolerance: ±10%; Published: 3/16/2016; LatestRevisionDate: 3/16/2016; LatestRevisionNote: ...; PackageReference: 1206 (3216 Metric); Publisher: AlbertaSat; PackageDescription: Radial Cap, Thru-Hole; 2 Leads; 0.3 in Pin Spacing; Part Number: PC-TDK-02917; Supplier Part Number 1: 445-6990-1-ND; Supplier 1: Digi-key; Supplier Link: http://www.digikey.ca/product-search/en?keywords=445-6990-1-ND; Voltage - Rated: 25V; Temperature Coefficient: X7R; Applications: Automotive
C23 = PC-TDK-02259: as C49 on sheet UHF Transceiver Schematic; Published: 2016-03-16; LatestRevisionDate: 2016-03-16; LatestRevisionNote: ...; PackageReference: 0402 (1005 Metric); Publisher: AlbertaSat; PackageDescription: Radial Cap, Thru-Hole; 2 Leads; 0.3 in Pin Spacing; Part Number: PC-TDK-02259; Supplier Part Number 1: 445-6899-1-ND; Supplier 1: Digi-key; Supplier Link: http://www.digikey.ca/product-search/en?keywords=445-6899-1-ND; Voltage - Rated: 50V; Temperature Coefficient: X7R; Applications: Automotive
C24 C28 C30 C32 C34 C36 = PC-TDK-02603: CAP CER 1UF 25V X7R 0603; Manufacturer Part Number: CGA3E1X7R1E105K080AC; Index: 2603; Designator: C?; Tolerance: ±10%; Published: 2016-03-16; LatestRevisionDate: 2016-03-16; LatestRevisionNote: ...; PackageReference: 0603 (1608 Metric); Publisher: AlbertaSat; PackageDescription: Radial Cap, Thru-Hole; 2 Leads; 0.3 in Pin Spacing; Part Number: PC-TDK-02603; Supplier Part Number 1: 445-6931-1-ND; Supplier 1: Digi-key; Supplier Link: http://www.digikey.ca/product-search/en?keywords=445-6931-1-ND; Voltage - Rated: 25V; Temperature Coefficient: X7R; Applications: Automotive
C25 = PC-TDK-01303: CAP CER 220PF 50V NP0 0402; Manufacturer Part Number: CGA2B2NP01H221J050BA; Index: 1303; Designator: C?; Tolerance: ±5%; Published: 2016-03-16; LatestRevisionDate: 2016-03-16; LatestRevisionNote: ...; PackageReference: 0402 (1005 Metric); Publisher: AlbertaSat; PackageDescription: Radial Cap, Thru-Hole; 2 Leads; 0.3 in Pin Spacing; Part Number: PC-TDK-01303; Supplier Part Number 1: 445-12129-1-ND; Supplier 1: Digi-key; Supplier Link: http://www.digikey.ca/product-search/en?keywords=445-12129-1-ND; Voltage - Rated: 50V; Temperature Coefficient: NP0; Applications: Automotive
C26 = PC-ATC-00072: CAP CER 1.2PF 250V C0G/NP0 0603; Manufacturer Part Number: 600S1R2AW250XT; Index: 72; Designator: C?; Tolerance: ±0.05pF; Temperature Coefficient: C0G, NP0; Published: 2018-08-29; LatestRevisionDate: 2018-08-29; LatestRevisionNote: ...; PackageReference: 0603 (1608 Metric); Publisher: AlbertaSat; PackageDescription: Radial Cap, Thru-Hole; 2 Leads; 0.3 in Pin Spacing; Part Number: PC-ATC-00072; Supplier Part Number 1: 1284-1721-1-ND; Supplier 1: Digi-key; Supplier Link: https://www.digikey.ca/products/en?keywords=1284-1721-1-ND; Voltage - Rated: 250V; Applications: High Q, Low Loss, Ultra Low ESR
C29 = PC-ATC-00302: CAP CER 27PF 250V NP0 0603; Manufacturer Part Number: 600S270FW250XT; Index: 302; Designator: C?; Tolerance: ±1%; Temperature Coefficient: C0G, NP0; Published: 2018-08-29; LatestRevisionDate: 2018-08-29; LatestRevisionNote: ...; PackageReference: 0603 (1608 Metric); Publisher: AlbertaSat; PackageDescription: Radial Cap, Thru-Hole; 2 Leads; 0.3 in Pin Spacing; Part Number: PC-ATC-00302; Supplier Part Number 1: 1284-1876-1-ND; Supplier 1: Digi-key; Supplier Link: https://www.digikey.ca/products/en?keywords=1284-1876-1-ND; Voltage - Rated: 250V; Applications: High Q, Low Loss, Ultra Low ESR
C33 = PC-ATC-00234: CAP CER 10PF 250V C0G/NP0 0603; Manufacturer Part Number: 600S100FW250XT; Index: 234; Designator: C?; Tolerance: ±1%; Temperature Coefficient: C0G, NP0; Published: 2018-08-29; LatestRevisionDate: 2018-08-29; LatestRevisionNote: ...; PackageReference: 0603 (1608 Metric); Publisher: AlbertaSat; PackageDescription: Radial Cap, Thru-Hole; 2 Leads; 0.3 in Pin Spacing; Part Number: PC-ATC-00234; Supplier Part Number 1: 1284-1159-1-ND; Supplier 1: Digi-key; Supplier Link: https://www.digikey.ca/products/en?keywords=1284-1159-1-ND; Voltage - Rated: 250V; Applications: High Q, Low Loss, Ultra Low ESR
C35 C37 C39 = PC-TDK-02742: CAP CER 2.2UF 50V X7R 0805; Manufacturer Part Number: CGA4J3X7R1H225K125AB; Index: 2742; Designator: C?; Tolerance: ±10%; Published: 2016-03-16; LatestRevisionDate: 2016-03-16; LatestRevisionNote: ...; PackageReference: 0805 (2012 Metric); Publisher: AlbertaSat; PackageDescription: Radial Cap, Thru-Hole; 2 Leads; 0.3 in Pin Spacing; Part Number: PC-TDK-02742; Supplier Part Number 1: 445-174216-1-ND; Supplier 1: Digi-key; Supplier Link: http://www.digikey.ca/product-search/en?keywords=445-174216-1-ND; Voltage - Rated: 50V; Temperature Coefficient: X7R; Applications: Automotive
C38 = PC-ATC-00379: CAP CER 220PF 250V C0G/NP0 0805; Manufacturer Part Number: 600F221JT250XT; Index: 379; Designator: C?; Tolerance: ±5%; Temperature Coefficient: C0G, NP0; Published: 2018-08-29; LatestRevisionDate: 2018-08-29; LatestRevisionNote: ...; PackageReference: 0805 (2012 Metric); Publisher: AlbertaSat; PackageDescription: Radial Cap, Thru-Hole; 2 Leads; 0.3 in Pin Spacing; Part Number: PC-ATC-00379; Supplier Part Number 1: 1284-1038-1-ND; Supplier 1: Digi-key; Supplier Link: https://www.digikey.ca/products/en?keywords=1284-1038-1-ND; Voltage - Rated: 250V; Applications: High Q, Low Loss, Ultra Low ESR
C40 C42 = PC-ATC-00229: CAP CER 10PF 200V C0G/NP0 0402; Manufacturer Part Number: 600L100FT200T; Index: 229; Designator: C?; Tolerance: ±1%; Temperature Coefficient: C0G, NP0; Published: 2018-08-29; LatestRevisionDate: 2018-08-29; LatestRevisionNote: ...; PackageReference: 0402 (1005 Metric); Publisher: AlbertaSat; PackageDescription: Chip Capacitor, 2-Leads, Body 1.02x0.51mm, IPC Low Density; Part Number: PC-ATC-00229; Supplier Part Number 1: 1284-1095-1-ND; Supplier 1: Digi-key; Supplier Link: https://www.digikey.ca/products/en?keywords=1284-1095-1-ND; Voltage - Rated: 200V; Applications: High Q, Low Loss, Ultra Low ESR
C41 = PC-ATC-00299: CAP CER 27PF 200V C0G/NP0 0402; Manufacturer Part Number: 600L270FT200T; Index: 299; Designator: C?; Tolerance: ±1%; Temperature Coefficient: C0G, NP0; Published: 2018-08-29; LatestRevisionDate: 2018-08-29; LatestRevisionNote: ...; PackageReference: 0402 (1005 Metric); Publisher: AlbertaSat; PackageDescription: Chip Capacitor, 2-Leads, Body 1.02x0.51mm, IPC Low Density; Part Number: PC-ATC-00299; Supplier Part Number 1: 1284-1361-1-ND; Supplier 1: Digi-key; Supplier Link: https://www.digikey.ca/products/en?keywords=1284-1361-1-ND; Voltage - Rated: 200V; Applications: High Q, Low Loss, Ultra Low ESR
C43 = PC-ATC-00068: CAP CER 1.2PF 200V C0G/NP0 0402; Manufacturer Part Number: 600L1R2AT200T; Index: 68; Designator: C?; Tolerance: ±0.05pF; Temperature Coefficient: C0G, NP0; Published: 2018-08-29; LatestRevisionDate: 2018-08-29; LatestRevisionNote: ...; PackageReference: 0402 (1005 Metric); Publisher: AlbertaSat; PackageDescription: Chip Capacitor, 2-Leads, Body 1.02x0.51mm, IPC Low Density; Part Number: PC-ATC-00068; Supplier Part Number 1: 1284-1106-1-ND; Supplier 1: Digi-key; Supplier Link: https://www.digikey.ca/products/en?keywords=1284-1106-1-ND; Voltage - Rated: 200V; Applications: High Q, Low Loss, Ultra Low ESR
C44 = PC-ATC-00281: CAP CER 22PF 200V C0G/NP0 0402; Manufacturer Part Number: 600L220FT200T; Index: 281; Designator: C?; Tolerance: ±1%; Temperature Coefficient: C0G, NP0; Published: 2018-08-29; LatestRevisionDate: 2018-08-29; LatestRevisionNote: ...; PackageReference: 0402 (1005 Metric); Publisher: AlbertaSat; PackageDescription: Chip Capacitor, 2-Leads, Body 1.02x0.51mm, IPC Low Density; Part Number: PC-ATC-00281; Supplier Part Number 1: 1284-1114-1-ND; Supplier 1: Digi-key; Supplier Link: https://www.digikey.ca/products/en?keywords=1284-1114-1-ND; Voltage - Rated: 200V; Applications: High Q, Low Loss, Ultra Low ESR
L3 = PL-CCI-00006: Fixed Inductors 1606 Micro Spring 12.55 nH 2 % 1.6 A; Manufacturer Part Number: 1606-10GLB; Code_IEC: 1005; Index: 6; Designator: L?; Published: 2018-06-17; LatestRevisionDate: 2018-06-17; LatestRevisionNote: ...; PackageReference: 1606-10GLC; Publisher: AlbertaSat; PackageDescription: Fixed Inductors 0402CS AEC-Q200 8.2 nH 2 % 0.68 A; Code_JEITA: 0402; Part Number: PL-CCI-00006; Supplier Part Number 1: 994-1606-10GLB; Supplier 1: Mouser; Supplier Link: #https://www.mouser.ca/ProductDetail/Coilcraft/1606-10GLB?qs=zCSbvcPd3pYulo8k3gupGQ%3d%3d#; Inductance: 12.55 nH
L4 = PL-CCI-00010: Fixed Inductors 0402CS AEC-Q200 8.2 nH 2 % 0.68 AFixed Inductors 0402CS AEC-Q200 8.2 nH 2 % 0.68 A / Fixed Inductors 0402CS AEC-Q200 8.2 nH 2 % 0.68 AFixed Inductors 1606 Micro Spring 12.55 nH 2 % 1.6 A / Fixed Inductors 0402CS AEC-Q200 8.2 nH 2 % 0.68 A; Code_IEC: 1005; Index: 10; Designator: L?; Published: 2018-06-17; LatestRevisionDate: 2018-06-17; LatestRevisionNote: ...; PackageReference: 0402 (1005 Metric); Publisher: AlbertaSat; PackageDescription: Chip Inductor, 2-Leads, Body 1.02x0.51mm, IPC Low Density; Code_JEITA: 0402; Part Number: PL-CCI-00010; Manufacturer Part Number: 0402CS-8N2XGLW; Supplier Part Number 1: 994-0402CS-8N2XGLW; Supplier 1: Mouser; Supplier Part Number 2: 0402CS-8N2XGLW / 0402CS-8N2XGLW; Supplier 2: Coilcraft Direct; Supplier Link: #https://www.mouser.ca/ProductDetail/Coilcraft/0402CS-8N2XGLW?qs=sGAEpiMZZMsg%252by3WlYCkU2kWFds1hA9D5FCqTFjMuAs%3d#
R13 R14 = 14828: RES SMD 390 OHM 0.1% 1/16W 0402; Part Number: 14828; Manufacturer Part Number: ERA-2ARB391X; Designator: R?; Power: 0.063W, 1/16W; Temperature Coefficient: ±10ppm/°C; Published: 8-Jun-2000; LatestRevisionDate: 29-May-2009; LatestRevisionNote: IPC-7351 Footprint Added.; PackageReference: 0402 (1005 Metric); Publisher: Altium Limited; PackageDescription: Chip Resistor, 2-Leads, Body 1.00x0.50mm, IPC Low Density; Supplier Part Number 1: P390CPCT-ND; Supplier 1: Digi-Key; Supplier Link: http://www.digikey.ca/product-search/en?keywords=P390CPCT-ND; Tolerance: ±0.1%
R15 R16 = 14464: RES SMD 220 OHM 0.1% 1/10W 0603; Part Number: 14464; Manufacturer Part Number: ERA-3AEB221V; Power: 0.1W, 1/10W; Temperature Coefficient: ±25ppm/°C; Published: 8-Jun-2000; LatestRevisionDate: 29-May-2009; LatestRevisionNote: IPC-7351 Footprint Added.; PackageReference: 0603 (1608 Metric); Publisher: Altium Limited; PackageDescription: Chip Resistor, 2-Leads, Body 1.60x0.80mm, IPC Low Density; Supplier Part Number 1: P220DBCT-ND; Supplier 1: Digi-Key; Supplier Link: http://www.digikey.ca/product-search/en?keywords=P220DBCT-ND; Tolerance: ±0.1%
R17 = 13127: RES SMD 0.0OHM JUMPER 1/10W 0402; Part Number: 13127; Manufacturer Part Number: ERJ-2GE0R00X; Designator: R?; Power: 0.1W, 1/10W; PackageDescription: Chip Resistor, 2-Leads, Body 1.00x0.50mm, IPC Low Density; Supplier Part Number 1: P0.0JCT-ND; Supplier 1: Digi-Key; Supplier Link: http://www.digikey.ca/product-search/en?keywords=P0.0JCT-ND; PackageReference: 0402 (1005 Metric); Tolerance: Jumper; Temperature Coefficient: -; Type: Jumper
TP1-TP5 = PTP-KS-00001: as TP6 on sheet UHF Transceiver Schematic; Supplier 1: Digi-key; Supplier 2: Newark; Supplier 3: Mouser; Part Number: PTP-KS-00001; Manufacturer Part Number: 5017; Supplier Part Number 1: 36-5017CT-ND; Publisher: AlbertaSat; Published: 2016-03-15; LatestRevisionDate: 2016-03-15; LatestRevisionNote: ...; PackageReference: KS-5017; PackageDescription: Testpoint Lug Mini SMD 27X10X152; Supplier Link: #http://www.digikey.ca/product-detail/en/keystone-electronics/5017/36-5017TR-ND/2217304#
U4 = 51: IC LOAD SWITCH 6A 8WSON; Part Number: 51; Manufacturer Part Number: TPS22965QWDSGTQ1; Designator: U?; Supplier Part Number 2: 595-TPS22965QWDSGRQ1; Supplier 2: Mouser; Supplier Part Number 1: 296-50067-1-ND; Supplier 1: Digi-Key; Supplier Link: #https://www.digikey.ca/product-detail/en/texas-instruments/TPS22965QWDSGTQ1/296-50067-1-ND/9462874#; PackageReference: 8-WFDFN Exposed Pad; Operating Temperature: -40°C ~ 125°C (TA)
U5 = PU-QRV-00001: RF Amplifier IC CDMA, GSM, EDGE 100MHz ~ 1GHz 24-LCC (4x4); Manufacturer Part Number: RF6886TR13; Index: 1; Designator: U?; Opperating Supply Current: 390 mA; Operating Frequency: 100MHz - 1 GHz; Gain: 31 dB; Operating Supply Voltage: 3.6 V; Part Number: PU-QRV-00001; Supplier Part Number 1: 772-RF6886; Supplier 1: Mouser; Supplier Part Number 2: RF6886TR13; Supplier 2: Avnet Asia; Publisher: AlbertaSat; Published: 2018-04-20; LatestRevisionDate: 2018-04-20; LatestRevisionNote: ...; PackageReference: 24-VFQFN Exposed Pad; PackageDescription: QFN-24; Supplier Link: #https://ca.mouser.com/ProductDetail/Qorvo/RF6886TR13?qs=sGAEpiMZZMuI1aKsGLfKZB%252b0jWhrXKds1WCZrINp87s%3d#; Operating Temperature: -40°C ~ 85°C (TA); Applications: General Purpose